# EAGLE design Cell Charger Controller rev1 (EAGLE 9.6.2)
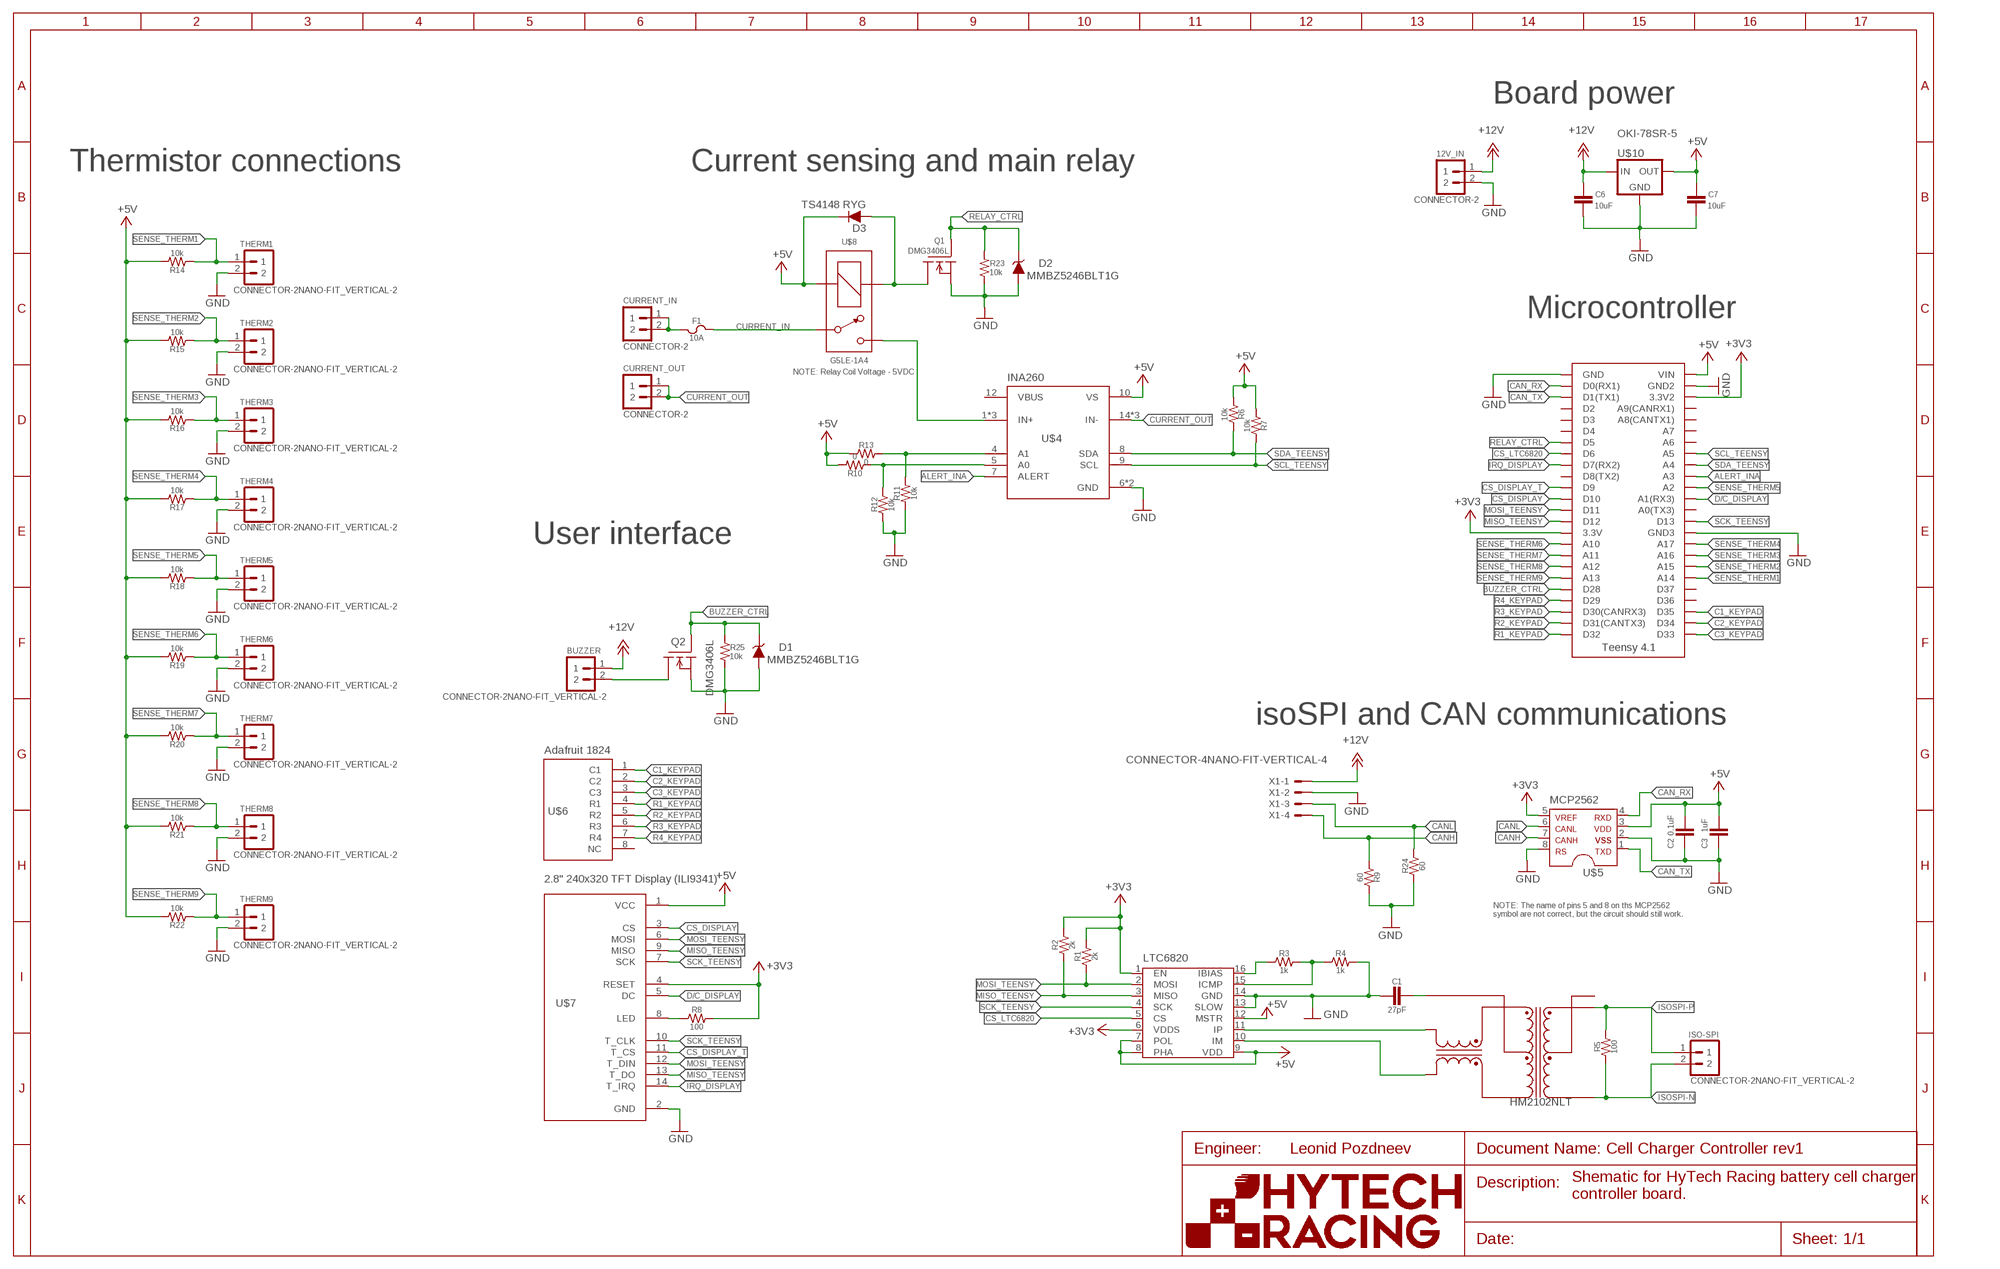
[diagram p0: schematic, sheet 1]
U$1 (FRAME_B): FRAME_DESCRIPTION: Default; ORIENTATION: LANDSCAPE; SIZE: B

## Parts
12V_IN  CONNECTOR-2  [39288020]
BUZZER  CONNECTOR-2NANO-FIT_VERTICAL-2  [1053091202]
C1  27pF  CAP0603-CAP  [0603-CAP]
C2  0.1uF  CAP0603-CAP  [0603-CAP]
C3  1uF  CAP0603-CAP  [0603-CAP]
C6  10uF  CAP0603-CAP  [0603-CAP]
C7  10uF  CAP0603-CAP  [0603-CAP]
CURRENT_IN  CONNECTOR-2  [39288020]
CURRENT_OUT  CONNECTOR-2  [39288020]
D1  MMBZ5246BLT1G  DIODE_ZENER  [SOT23]
D2  MMBZ5246BLT1G  DIODE_ZENER  [SOT23]
D3  TS4148 RYG  DIODE0805  [0805_D]
F1  10A  FUSE_MINIBLADE  [MINI-BLADE_FUSE_HOLDER]
ISO-SPI  CONNECTOR-2NANO-FIT_VERTICAL-2  [1053091202]
Q1  DMG3406L  DMG3406LSOT  [SOT23]
Q2  DMG3406L  DMG3406LSOT  [SOT23]
R1  2k  RESISTOR0603  [0603-RES]
R2  2k  RESISTOR0603  [0603-RES]
R3  1k  RESISTOR0603  [0603-RES]
R4  1k  RESISTOR0603  [0603-RES]
R5  100  RESISTOR0603  [0603-RES]
R6  10k  RESISTOR0603  [0603-RES]
R7  10k  RESISTOR0603  [0603-RES]
R8  100  RESISTOR0603  [0603-RES]
R9  60  RESISTOR0603  [0603-RES]
R10  0  RESISTOR0603  [0603-RES]
R11  10k  RESISTOR0603  [0603-RES]
R12  10k  RESISTOR0603  [0603-RES]
R13  0  RESISTOR0603  [0603-RES]
R14  10k  RESISTOR0603  [0603-RES]
R15  10k  RESISTOR0603  [0603-RES]
R16  10k  RESISTOR0603  [0603-RES]
R17  10k  RESISTOR0603  [0603-RES]
R18  10k  RESISTOR0603  [0603-RES]
R19  10k  RESISTOR0603  [0603-RES]
R20  10k  RESISTOR0603  [0603-RES]
R21  10k  RESISTOR0603  [0603-RES]
R22  10k  RESISTOR0603  [0603-RES]
R23  10k  RESISTOR0603  [0603-RES]
R24  60  RESISTOR0603  [0603-RES]
R25  10k  RESISTOR0603  [0603-RES]
THERM1  CONNECTOR-2NANO-FIT_VERTICAL-2  [1053091202]
THERM2  CONNECTOR-2NANO-FIT_VERTICAL-2  [1053091202]
THERM3  CONNECTOR-2NANO-FIT_VERTICAL-2  [1053091202]
THERM4  CONNECTOR-2NANO-FIT_VERTICAL-2  [1053091202]
THERM5  CONNECTOR-2NANO-FIT_VERTICAL-2  [1053091202]
THERM6  CONNECTOR-2NANO-FIT_VERTICAL-2  [1053091202]
THERM7  CONNECTOR-2NANO-FIT_VERTICAL-2  [1053091202]
THERM8  CONNECTOR-2NANO-FIT_VERTICAL-2  [1053091202]
THERM9  CONNECTOR-2NANO-FIT_VERTICAL-2  [1053091202]
U1  HM2102NLT  [HM2102NLT]
U$2  TEENSY_4.1_SIMPLE  [TEENSY_4.1_SIMPLE]
U$3  LTC6820  [MSOP-16]
U$4  INA260  [TSSOP-16]
U$5  MCP2562FD  [SOIC-08]
U$6  ADAFRUIT_1824_KEYPAD  [ADAFRUIT_1824_KEYPAD]
U$7  ILI9341_TOUCH_SCREEN  [ILI9341_TOUCH_SCREEN]
U$8  G5LE-1A4  [G5LE-1A4]
U$10  OKI-78SR-5  [OKI-78SR]
X1  CONNECTOR-4NANO-FIT-VERTICAL-4  [1053101204]

## Nets
+3V3: R1.2 R2.2 R8.2 U$2.3.3V U$2.3.3V2 U$3.1(EN) U$3.6(VDDS) U$5.5 U$7.4(RESET)
+5V: C2.1 C3.1 C7.1 D3.C R6.1 R7.1 R10.2 R13.1 R14.2 R15.2 R16.2 R17.2 R18.2 R19.2 R20.2 R21.2 R22.2 U$2.VIN U$3.7(POL) U$3.8(PHA) U$3.9(VDD) U$3.12(MSTR) U$4.10(VS) U$5.3 U$7.1(VCC) U$8.2(COIL-) U$10.3(OUT)
+12V: 12V_IN.1 BUZZER.1 C6.1 U$10.1(IN) X1.1
ALERT_INA: U$2.A3 U$4.7(ALERT)
BUZZER_CTRL: D1.3(C) Q2.1(G) R25.2 U$2.D28
C1_KEYPAD: U$2.D35 U$6.1(C1)
C2_KEYPAD: U$2.D34 U$6.2(C2)
C3_KEYPAD: U$2.D33 U$6.3(C3)
CAN_RX: U$2.D0(RX1) U$5.4
CAN_TX: U$2.D1(TX1) U$5.1
CANH: R9.1 U$5.7 X1.4
CANL: R24.2 U$5.6 X1.3
CS_DISPLAY: U$2.D10 U$7.3(CS)
CS_DISPLAY_T: U$2.D9 U$7.11(T_CS)
CS_LTC6820: U$2.D6 U$3.5(CS)
CURRENT_IN: F1.R1 F1.R2 U$8.P
CURRENT_OUT: CURRENT_OUT.1 CURRENT_OUT.2 U$4.14(IN-) U$4.15(IN-) U$4.16(IN-)
D/C_DISPLAY: U$2.A1(RX3) U$7.5(DC)
GND: 12V_IN.2 C1.2 C2.2 C3.2 C6.2 C7.2 D1.1(A) D2.1(A) Q1.2(S) Q2.2(S) R4.2 R9.2 R11.1 R12.1 R23.1 R24.1 R25.1 THERM1.2 THERM2.2 THERM3.2 THERM4.2 THERM5.2 THERM6.2 THERM7.2 THERM8.2 THERM9.2 U$2.GND U$2.GND2 U$2.GND3 U$3.13(SLOW) U$3.14(GND) U$4.6(GND) U$4.11(GND) U$5.2 U$5.8 U$7.2(GND) U$10.2(GND) X1.2
IRQ_DISPLAY: U$2.D7(RX2) U$7.14(T_IRQ)
ISOSPI-N: ISO-SPI.2 R5.1 U1.P$3(MX-)
ISOSPI-P: ISO-SPI.1 R5.2 U1.P$1(MX+)
MISO_TEENSY: R2.1 U$2.D12 U$3.3(MISO) U$7.9(MISO) U$7.13(T_DO)
MOSI_TEENSY: R1.1 U$2.D11 U$3.2(MOSI) U$7.6(MOSI) U$7.12(T_DIN)
N$1: C1.1 U1.P$11(TCT)
N$2: U1.P$12(TD+) U$3.11(IP)
N$3: U1.P$10(TD-) U$3.10(IM)
N$4: R3.1 U$3.16(IBIAS)
N$5: R3.2 R4.1 U$3.15(ICMP)
N$6: R11.2 R13.2 U$4.4(A1)
N$7: R10.1 R12.2 U$4.5(A0)
N$10: R8.1 U$7.8(LED)
N$11: CURRENT_IN.1 CURRENT_IN.2 F1.L1 F1.L2
N$12: U$4.1(IN+) U$4.2(IN+) U$4.3(IN+) U$8.S
N$15: D3.A Q1.3(D) U$8.1(COIL+)
N$16: BUZZER.2 Q2.3(D)
R1_KEYPAD: U$2.D32 U$6.4(R1)
R2_KEYPAD: U$2.D31(CANTX)(D31(CANTX3)) U$6.5(R2)
R3_KEYPAD: U$2.D30(CANRX)(D30(CANRX3)) U$6.6(R3)
R4_KEYPAD: U$2.D29 U$6.7(R4)
RELAY_CTRL: D2.3(C) Q1.1(G) R23.2 U$2.D5
SCK_TEENSY: U$2.D13 U$3.4(SCK) U$7.7(SCK) U$7.10(T_CLK)
SCL_TEENSY: R7.2 U$2.A5 U$4.9(SCL)
SDA_TEENSY: R6.2 U$2.A4 U$4.8(SDA)
SENSE_THERM1: R14.1 THERM1.1 U$2.A14
SENSE_THERM2: R15.1 THERM2.1 U$2.A15
SENSE_THERM3: R16.1 THERM3.1 U$2.A16
SENSE_THERM4: R17.1 THERM4.1 U$2.A17
SENSE_THERM5: R18.1 THERM5.1 U$2.A2
SENSE_THERM6: R19.1 THERM6.1 U$2.A10
SENSE_THERM7: R20.1 THERM7.1 U$2.A11
SENSE_THERM8: R21.1 THERM8.1 U$2.A12
SENSE_THERM9: R22.1 THERM9.1 U$2.A13
Unconnected: U1.P$2(MCT) U1.P$4(MX+) U1.P$5(MCT) U1.P$6(MX-) U1.P$7(TD-) U1.P$8(TCT) U1.P$9(TD+) U$2.A0(TX3) U$2.A6 U$2.A7 U$2.A8(CANTX2)(A8(CANTX1)) U$2.A9(CANRX2)(A9(CANRX1)) U$2.D2 U$2.D3 U$2.D4 U$2.D8(TX2) U$2.D36 U$2.D37 U$4.12(VBUS) U$6.8(NC)

## Notes on the sheet
- Board power
- Thermistor connections | Current sensing and main relay
- Microcontroller
- NOTE: Relay Coil Voltage - 5VDC
- INA260
- User interface
- isoSPI and CAN communications
- MCP2562
- NOTE: The name of pins 5 and 8 on ths MCP2562 
  symbol are not correct, but the circuit should still work.
- LTC6820
- Leonid Pozdneev
- Shematic for HyTech Racing battery cell charger
  controller board.

## Library data of the parts
12V_IN CURRENT_IN CURRENT_OUT = HyTechDevices:CONNECTOR-2: Mini-Fit Junior connector 2 pole Source: http://www.molex.com; OC_FARNELL: 1822072; OC_NEWARK: unknown
BUZZER ISO-SPI THERM1-THERM9 = HyTechDevices:CONNECTOR-2: Mini-Fit Junior connector 2 pole Source: http://www.molex.com
C1-C3 C6 C7 = HyTechDevices:CAP: Capacitor Standard 0603 ceramic capacitor, and 0.1" leaded capacitor.
D1 D2 = HyTechDevices:DIODE_ZENER: ZENER DIODE
D3 = HyTechDevices:DIODE: DIODE general purpose rectifier
F1 = HyTechDevices:FUSE: Fuse/Fuseclips Keystone Electronics 3568 Fuse Mouser Part <http://www.mouser.com/ProductDetail/Keystone-Electronics/3568> Datasheet <http://www.mouser.com/ds/2/215/568-742601.pdf> Bussman/Eaton Midget Fuse Clip 1A3400 <http://www.mouser.com/ProductDetail/Bussmann-Eaton/BK-1A3400-09-R/?qs=sGAEpiMZZMuG%252bgnN5hGYGzzlAelq2OxnKqVSMVjq8I4%3d> Schurter 0751.0110 Brass Fuse Clip Datasheet <http://www.mouser.com/ds/2/358/typ_OG__Clip__5x20-2553.pdf> Bel Fuse 0ZCF Series Surface Mount PTC (resettable) Fuse Datasheet <https://belfuse.com/resources/CircuitProtection/datasheets/0ZCF%20Nov2016.pdf> Littelfuse 1812L Series Surface Mount PTC (resettable) Fuse Datasheet <https://m.littelfuse.com/~/media/electronics/datasheets/resettable_ptcs/littelfuse_ptc_1812l_datasheet.pdf.pdf>
Q1 Q2 = HyTechDevices:DMG3406L: Generic NPN MOSFET DMG3406L (SOT-23, 2.8 A 30V)
R1-R25 = HyTechDevices:RESISTOR: Resistor Basic schematic elements and footprints for 0603, 1206, and PTH resistors.
U1 = HyTechDevices:HM2102NLT: 2 Channel SMT Transformer Turns ratio: 1CT: 1CT Isolation Voltage: 4300 VDC Inductance: 150 uH Leakage Inductance: 0.50 uH max DataSheet <https://www.mouser.com/datasheet/2/336/HM2102NL-1218600.pdf>
U$2 = HyTechDevices:TEENSY_4.1_SIMPLE: Simple version of the Teensy 4.1 board that only uses the 2 main rows of pins, with no perpendicular row with VBat or inner pins.
U$3 = HyTechDevices:LTC6820: Linear Technology isoSPI Isolated Communications Interface Datasheet <http://cds.linear.com/docs/en/datasheet/6820fb.pdf>
U$4 = HyTechDevices:INA260: Digital-output, current, power, and voltage monitor with an I2C and SMBus-compatible interface with an integrated precision shunt resistor. Datasheet <https://www.ti.com/lit/ds/symlink/ina260.pdf?HQS=dis-dk-null-digikeymode-dsf-pf-null-wwe&ts=1616279700017>
U$5 = HyTechDevices:MCP2562FD: MCP2562FD High-Speed CAN Transceiver Product Webpage <https://www.microchip.com/wwwproducts/en/MCP2562FD> Datasheet <https://ww1.microchip.com/downloads/en/DeviceDoc/20005284A.pdf>
U$6 = HyTechDevices:ADAFRUIT_1824_KEYPAD: Adafruit 3x4 matrix keypad (PID 1824) Product page <https://www.adafruit.com/product/1824#description>
U$7 = HyTechDevices:ILI9341_TOUCH_SCREEN: 2.8" 240x320 TFT Touch Screen Display. Uses the ILI9341 controller with SPI interface. It also includes a resistive touchscreen with built-in XPT2046 controller. Product page <https://protosupplies.com/product/tft-lcd-2-8-240x320-rgb-spi-display-with-touchscreen/>
U$8 = HyTechDevices:G5LE-1A4: Omron G5LE SPST Relay DC12 (12VDC) model used Coil voltage: 75% - 170% of nominal voltage Datasheet <https://www.omron.com/ecb/products/pdf/en-g5le.pdf>
U$10 = HyTechDevices:OKI-78SR-5: Murata OKI-78SR 5V 1.5A Non-Isolated Switching Regulator DC/DC - Datasheet <https://power.murata.com/data/power/oki-78sr.pdf>
X1 = HyTechDevices:CONNECTOR-4: Mini-Fit Junior connector 4 pole Source: http://www.molex.com

## Board
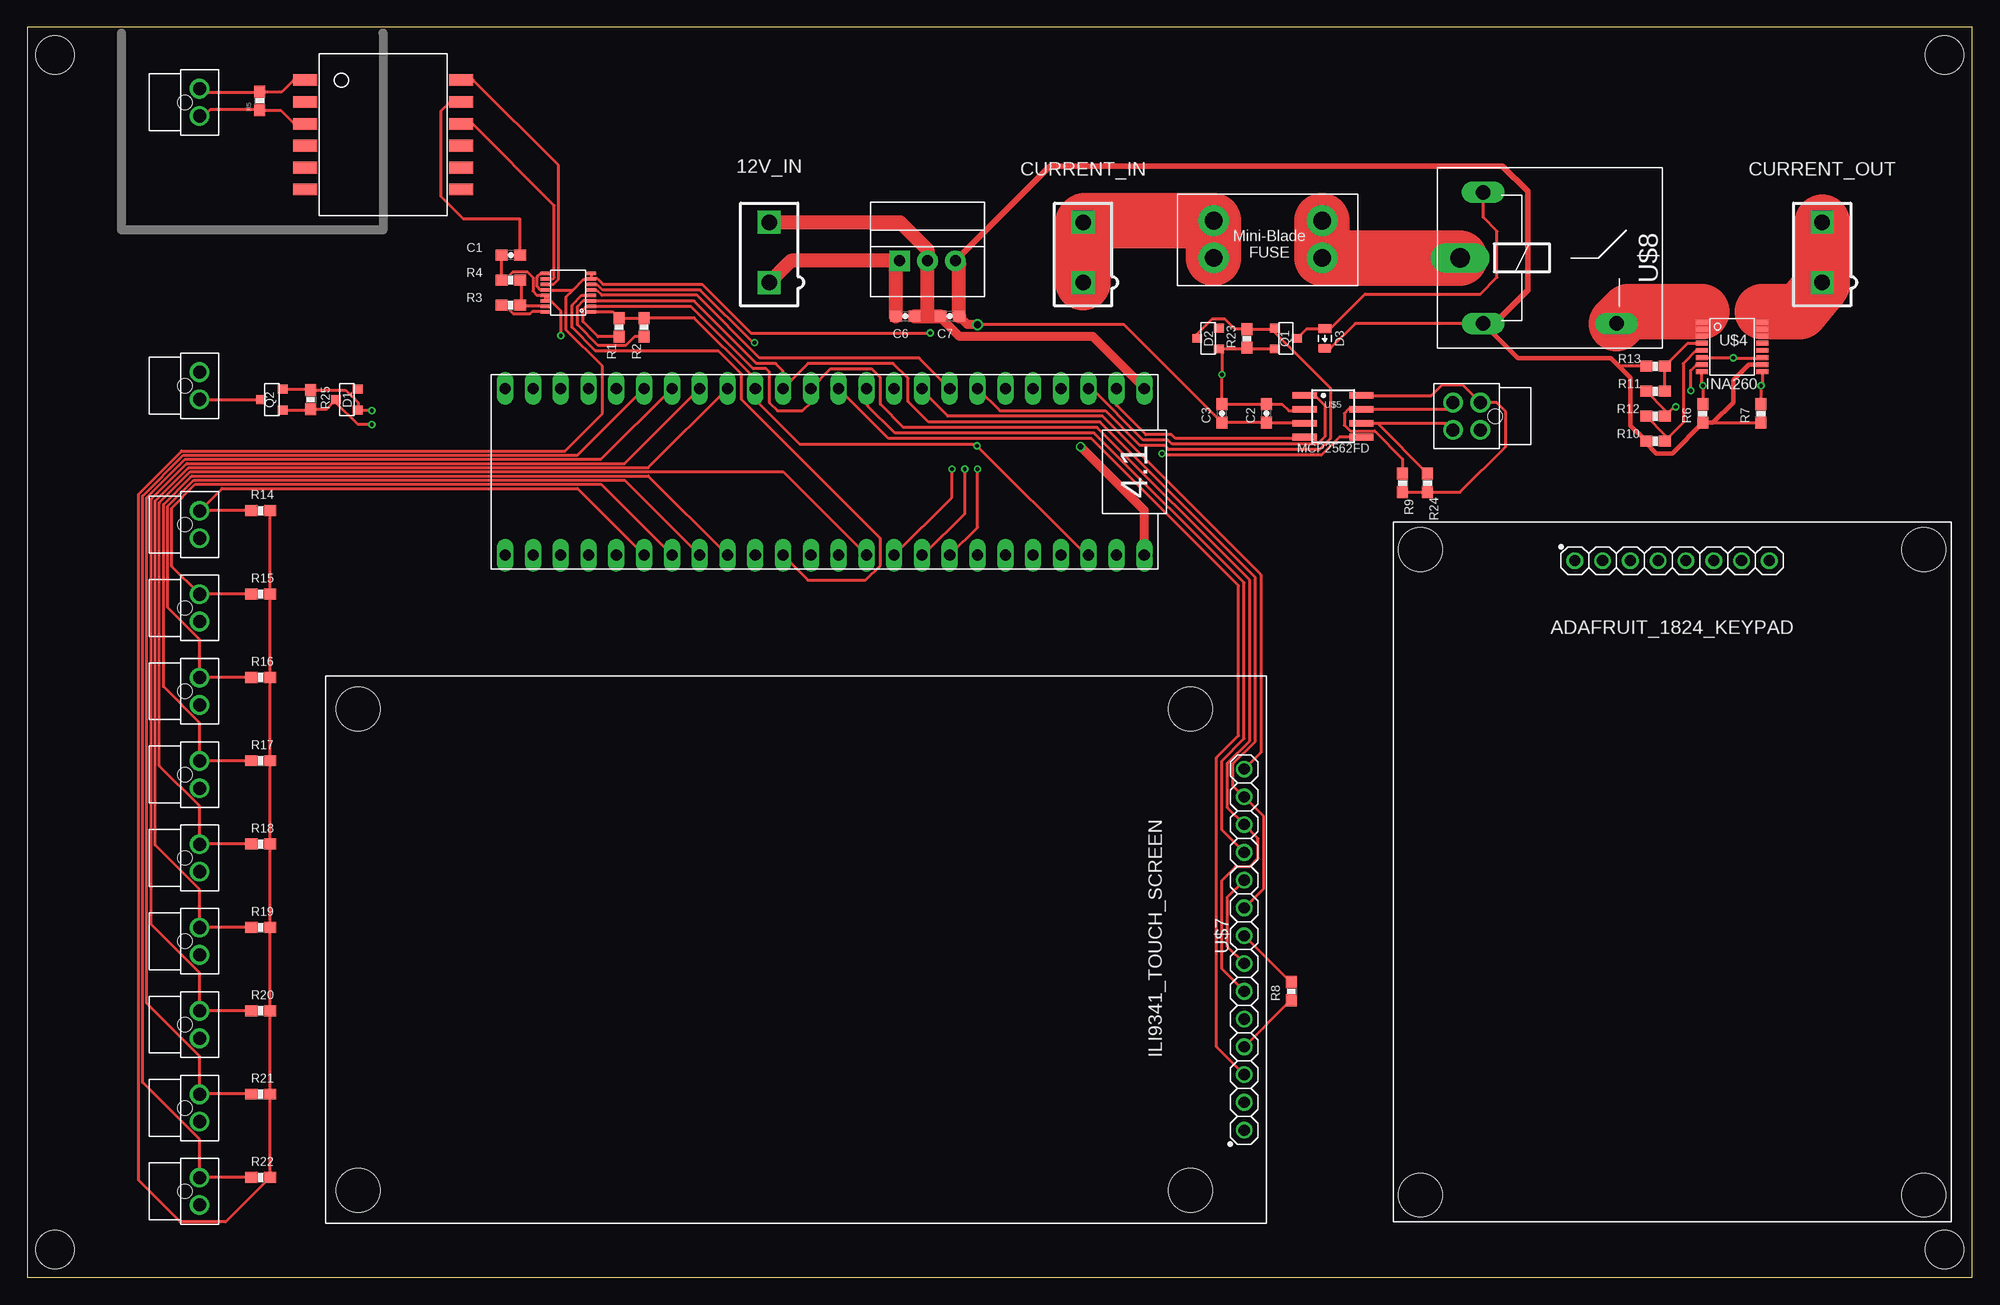
[diagram p1: board, top side]
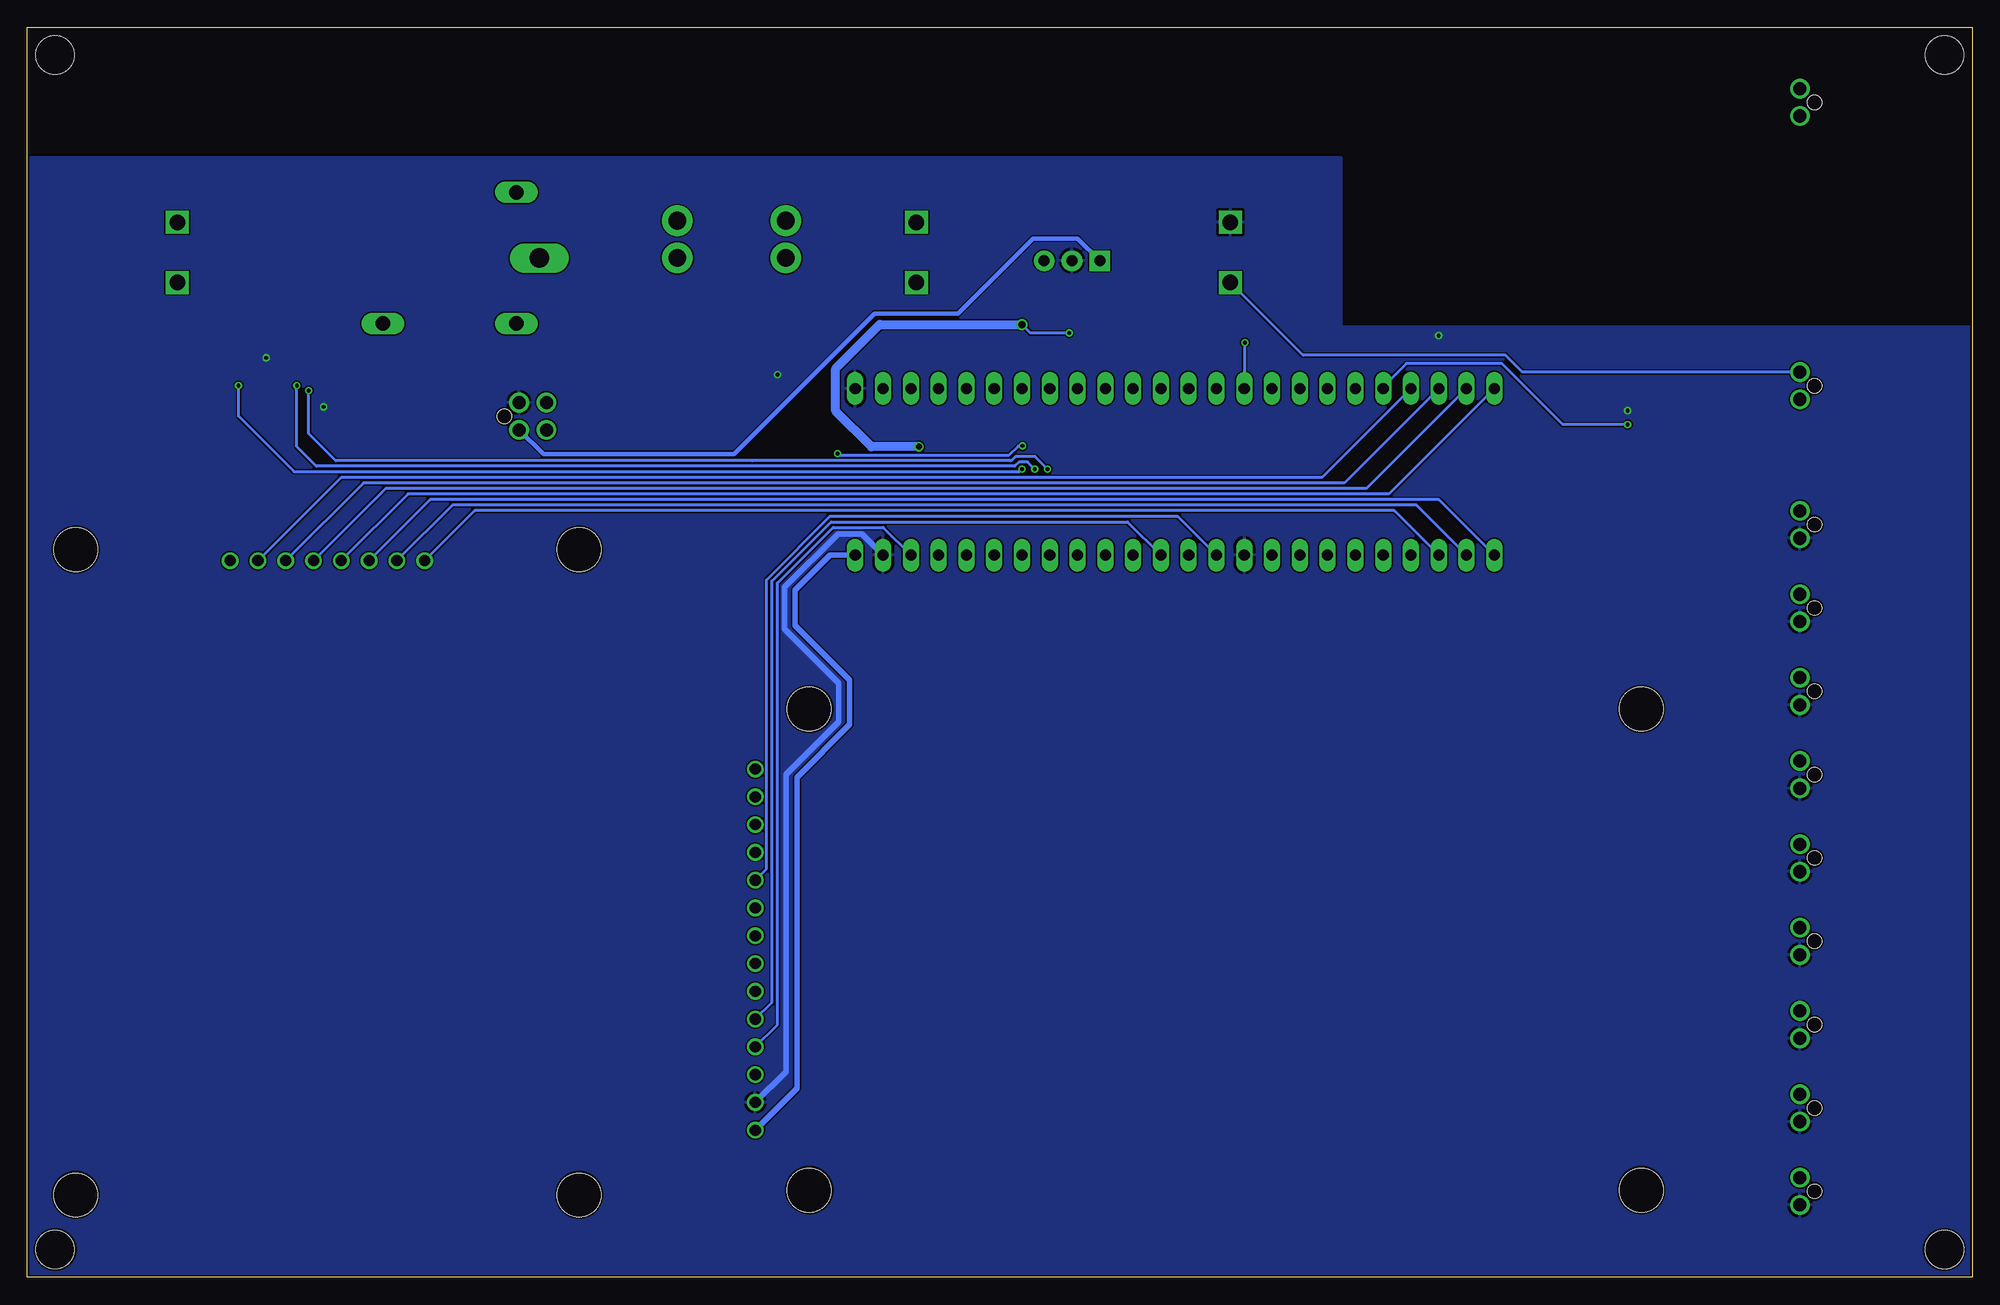
[diagram p2: board, bottom side, seen from below]

Size 177.8 x 114.3 mm. Coordinates in mm from the lower left corner, seen from the top.
Outline: 0,0 177.8,0 177.8,114.3 0,114.3 0,0
Copper layers (1*16): Top 0.035mm / dielectric 1.53mm / Bottom 0.035mm
Design rules "JLCPCB (2 Layer)": minimum track width 5mil, minimum drill 0.3mm, track to track 5mil, track to pad 5mil, pad to pad 5mil, via to via 20mil, smd to smd 5mil, copper to edge 0.2mm, drill to drill 21mil, minimum pad ring 6mil, minimum via ring 6mil, stop-mask expansion 6mil, vias tented up to drill 30mil, thermal gap 10mil
Holes 3.51 mm at 2.54,111.76 2.54,2.54 175.26,2.54 175.26,111.76

### Footprints (pad centres in the part's own frame; a part is rotated, then mirrored left to right if it is on the bottom)
39288020 = drill 1.4 square: 1 0,-2.75; 2 0,2.75
1053091202 = drill 1.2: 1 -1.25,0; 2 1.25,0 | hole 1.3: 0,-1.34
0603-CAP = smd 1.1 x 1: 1 -0.85,0; 2 0.85,0
SOT23 = smd 0.8 x 0.9: 1 -0.95,-1; 2 0.95,-1; 3 0,1
0805_D = smd 0.8 x 1.2: A -0.9,0; C 0.9,0
MINI-BLADE_FUSE_HOLDER = drill 1.613 pad 2.794: L1 0,3.404; L2 0,0; R1 9.906,3.404; R2 9.906,0
0603-RES = smd 1.1 x 1: 1 -0.85,0; 2 0.85,0
HM2102NLT = smd 1.067 x 2.184: P$1 0,0; P$2 2,0; P$3 4,0; P$4 6,0; P$5 8,0; P$6 10,0; P$7 10,14.25; P$8 8,14.25; P$9 6,14.25; P$10 4,14.25; P$11 2,14.25; P$12 0,14.25
TEENSY_4.1_SIMPLE = drill 1.016 long: 3.3V 1.27,24.13; 3.3V2 16.51,54.61; A0(TX3) 16.51,29.21; A1(RX3) 16.51,31.75; A2 16.51,34.29; A3 16.51,36.83; A4 16.51,39.37; A5 16.51,41.91; A6 16.51,44.45; A7 16.51,46.99; A8(CANTX2) 16.51,49.53; A9(CANRX2) 16.51,52.07; A10 1.27,21.59; A11 1.27,19.05; A12 1.27,16.51; A13 1.27,13.97; A14 16.51,13.97; A15 16.51,16.51; A16 16.51,19.05; A17 16.51,21.59; D0(RX1) 1.27,57.15; D1(TX1) 1.27,54.61; D2 1.27,52.07; D3 1.27,49.53; D4 1.27,46.99; D5 1.27,44.45; D6 1.27,41.91; D7(RX2) 1.27,39.37; D8(TX2) 1.27,36.83; D9 1.27,34.29; D10 1.27,31.75; D11 1.27,29.21; D12 1.27,26.67; D13 16.51,26.67; D28 1.27,11.43; D29 1.27,8.89; D30(CANRX) 1.27,6.35; D31(CANTX) 1.27,3.81; D32 1.27,1.27; D33 16.51,1.27; D34 16.51,3.81; D35 16.51,6.35; D36 16.51,8.89; D37 16.51,11.43; GND 1.27,59.69; GND2 16.51,57.15; GND3 16.51,24.13; VIN 16.51,59.69
MSOP-16 = smd 0.305 x 0.889: 1 -0.1,-0.5; 2 0.4,-0.5; 3 0.9,-0.5; 4 1.4,-0.5; 5 1.9,-0.5; 6 2.4,-0.5; 7 2.9,-0.5; 8 3.4,-0.5; 9 3.4,3.7; 10 2.9,3.7; 11 2.4,3.7; 12 1.9,3.7; 13 1.4,3.7; 14 0.9,3.7; 15 0.4,3.7; 16 -0.1,3.7
TSSOP-16 = smd 0.45 x 1.1: 1 -2.275,-2.618; 2 -1.625,-2.618; 3 -0.975,-2.618; 4 -0.325,-2.618; 5 0.325,-2.618; 6 0.975,-2.618; 7 1.625,-2.618; 8 2.275,-2.618; 9 2.275,2.918; 10 1.625,2.918; 11 0.975,2.918; 12 0.325,2.918; 13 -0.325,2.918; 14 -0.975,2.918; 15 -1.625,2.918; 16 -2.275,2.918
SOIC-08 = smd 0.6 x 2.2: 1 -1.905,-2.6; 2 -0.635,-2.6; 3 0.635,-2.6; 4 1.905,-2.6; 5 1.905,2.6; 6 0.635,2.6; 7 -0.635,2.6; 8 -1.905,2.6
ADAFRUIT_1824_KEYPAD = drill 1.016: 1 1.27,0; 2 3.81,0; 3 6.35,0; 4 8.89,0; 5 11.43,0; 6 13.97,0; 7 16.51,0; 8 19.05,0 | hole 3.988: -12.852,1.016; 33.172,1.016; -12.852,-57.988; 33.172,-57.988
ILI9341_TOUCH_SCREEN = drill 1.016: 1 0,0; 2 2.54,0; 3 5.08,0; 4 7.62,0; 5 10.16,0; 6 12.7,0; 7 15.24,0; 8 17.78,0; 9 20.32,0; 10 22.86,0; 11 25.4,0; 12 27.94,0; 13 30.48,0; 14 33.02,0 | hole 4.013: 38.506,4.928; -5.486,4.928; -5.486,81.001; 38.506,81.001
G5LE-1A4 = drill 1.321 long: 1 4.064,14.884; 2 4.064,2.896; S 16.256,2.896 | drill 1.803 long: P 1.956,8.89
OKI-78SR = drill 1 pad 1.88 square: 1 -2.54,0 | drill 1 pad 1.88: 2 0,0; 3 2.54,0
1053101204 = drill 1.2: 1 -1.25,0; 2 1.25,0; 3 -1.25,2.5; 4 1.25,2.5 | hole 1.3: 0,-1.34

### Placement (x,y rotation side)
12V_IN  67.82,93.73 0 top
BUZZER  15.75,81.53 270 top
C1  44.2,93.47 180 top
C2  113.28,78.99 90 top
C3  109.22,78.99 90 top
C6  80.26,87.88 0 top
C7  84.33,87.88 180 top
CURRENT_IN  96.52,93.73 0 top
CURRENT_OUT  164.08,93.73 0 top
D1  29.21,80.26 90 top
D2  107.95,85.85 90 top
D3  118.62,85.85 270 top
F1  108.46,93.22 0 top
ISO-SPI  15.75,107.44 270 top
Q1  115.06,85.85 270 top
Q2  22.35,80.26 90 top
R1  54.1,86.87 90 top
R2  56.39,86.87 90 top
R3  44.2,88.9 0 top
R4  44.2,91.19 180 top
R5  21.26,107.57 90 top
R6  153.16,78.99 90 top
R7  158.5,78.99 90 top
R8  115.57,26.16 270 top
R9  125.73,72.64 270 top
R10  148.84,76.45 180 top
R11  148.84,81.03 0 top
R12  148.84,78.74 180 top
R13  148.84,83.31 0 top
R14  21.34,70.1 0 top
R15  21.34,62.48 0 top
R16  21.34,54.86 0 top
R17  21.34,47.24 0 top
R18  21.34,39.62 0 top
R19  21.34,32 0 top
R20  21.34,24.38 0 top
R21  21.34,16.76 0 top
R22  21.34,9.14 0 top
R23  111.51,85.85 90 top
R24  128.02,72.64 90 top
R25  25.91,80.26 270 top
THERM1  15.75,68.83 270 top
THERM2  15.75,61.21 270 top
THERM3  15.75,53.59 270 top
THERM4  15.75,45.97 270 top
THERM5  15.75,38.35 270 top
THERM6  15.75,30.73 270 top
THERM7  15.75,23.11 270 top
THERM8  15.75,15.49 270 top
THERM9  15.75,7.87 270 top
U1  25.4,109.47 270 top
U$2  42.42,82.55 270 top
U$3  51.05,88.39 90 top
U$4  155.7,85.09 270 top
U$5  119.38,78.74 270 top
U$6  140.21,65.53 0 top
U$7  111.25,13.46 90 top
U$8  129.03,84.33 0 top
U$10  82.3,92.96 0 top
X1  132.84,78.74 90 top

### Tracks (layer width: path | path; a pad name or v marks a point on that pad's centre or on a via)
+3V3  (via drill 0.35)
  Top 0.254: U$7.4 115.48,25.31 R8.2 | U$3.1 53.53,88.29 R1.2 R2.2 60.96,87.72 66.42,82.25 66.42,81.41 U$2.3.3V 66.67,81.15 66.67,80.11 70.58,76.2 86.65,76.2 v86.82,76.03 96.81,66.04 U$2.3.3V2 | U$3.6 52.09,90.79 52.59,90.28 61.52,90.28 66.33,85.48 v66.48,85.48 | U$5.5 119.95,76.83 118.3,75.18 103.89,75.18 v103.73,75.34
  Bottom 0.254: U$7.4 109.22,23.11 109.22,63.5 104.14,68.58 99.57,68.58 U$2.3.3V2 | v66.48,85.48 66.55,85.41 U$2.3.3V | v86.82,76.03 87.2,76.03 88.06,75.18 103.57,75.18 v103.73,75.34
+5V  (via drill 0.35, 0.55, 0.65)
  Top 0.254: U$8.2 121.41,87.22 119.14,84.95 D3.C | R14.2 R15.2 R16.2 R17.2 R18.2 R19.2 R20.2 R21.2 R22.2 18.12,5.08 13.97,5.08 10.16,8.89 10.16,71.62 14.1,75.56 49.15,75.56 52.58,78.99 52.58,83.31 49.28,86.61 49.28,89.67 49.9,90.29 | U$5.3 113.32,78.11 C2.1 C3.1 100.24,87.12 v86.87,87.12 | v82.55,86.36 66.14,86.36 61.7,90.8 52.62,90.8 52.12,91.3 51.56,91.3 U$3.7 | U$3.8 U$3.7 | U$3.7 51.54,91.28 50.88,91.28 49.9,90.29 | 49.9,90.29 U$3.12 46.89,90.29 46.6,90.57 46.6,91.5 46.91,91.8 U$3.9 | R6.1 R7.1 | R13.1 145.54,83.31 144.78,84.07
  Top 0.406: U$4.10 157.38,83.47 155.96,82.04 155.96,80.01 154.09,78.14 R6.1 150.37,75.35 148.93,75.35 147.99,76.29 R10.2 146.56,77.89 146.56,82.3 144.78,84.07 136.25,84.07 U$8.2
  Top 0.508: U$10.3 93.47,101.6 134.87,101.6 137.16,99.31 137.16,90.27 134.11,87.22 U$8.2
  Top 0.813: U$2.VIN 102.11,70.13 v96.29,75.95 | v86.87,87.12 85.94,87.12 C7.1
  Top 1.27: C7.1 85.18,92.62 U$10.3
  Bottom 0.254: v82.55,86.36 86.11,86.36 v86.87,87.12
  Bottom 0.508: U$7.1 107.44,17.27 107.44,45.72 102.62,50.55 102.62,54.61 107.59,59.59 107.59,62.84 104.39,66.04 U$2.VIN
  Bottom 0.813: v96.29,75.95 100.64,75.95 103.91,79.22 103.91,83.09 99.88,87.12 v86.87,87.12
+12V
  Top 1.27: C6.1 79.41,92.62 U$10.1 69.81,92.96 12V_IN.1
  Bottom 0.254: BUZZER.1 41.13,82.78 42.67,84.33 61.17,84.33 12V_IN.1
  Bottom 0.406: U$10.1 81.79,95 85.85,95 92.71,88.14 100.33,88.14 113.21,75.26 130.61,75.26 X1.1
ALERT_INA  (via drill 0.35)
  Top 0.254: U$2.A3 84.53,71.32 v84.53,73.91 | U$4.7 152.61,83.47 152.06,82.93 v152.06,81.09
  Bottom 0.254: v152.06,81.09 152.06,77.14 149.6,74.67 111.5,74.67 87.83,74.67 87.45,75.05 85.67,75.05 v84.53,73.91
BUZZER_CTRL  (via drill 0.35)
  Top 0.254: Q2.1 25.81,79.31 R25.2 27.36,79.41 D1.3 28.21,79.99 30.23,77.98 v31.5,77.98
  Bottom 0.254: v31.5,77.98 37.42,77.98 43.01,83.57 51.73,83.57 53.85,81.45 U$2.D28
C1_KEYPAD
  Bottom 0.254: U$2.D35 52.83,70.1 136.91,70.1 U$6.1
C2_KEYPAD
  Bottom 0.254: U$2.D34 50.8,70.61 138.94,70.61 U$6.2
C3_KEYPAD
  Bottom 0.254: U$2.D33 48.77,71.12 140.97,71.12 U$6.3
CAN_RX
  Top 0.254: U$5.4 116.65,76.71 104.97,76.71 104.61,77.06 102.26,77.06 99.57,79.76 U$2.D0(RX1)
CAN_TX
  Top 0.254: U$5.1 116.91,80.52 117.81,80.52 118.62,79.7 118.62,76.86 117.96,76.2 104.65,76.2 104.27,76.58 102.01,76.58 97.31,81.28 U$2.D1(TX1)
CANH
  Top 0.254: X1.4 129.73,79.38 U$5.7 120.78,79.38 120.4,78.99 120.4,77.93 120.94,77.39 123.19,77.39 125.73,74.84 R9.1
CANL
  Top 0.254: X1.3 129.73,78.11 U$5.6 123.41,78.11 R24.2
CS_DISPLAY
  Top 0.254: U$7.3 108.71,21.08 108.71,47.53 110.73,49.55 110.73,63.26 97.28,76.71 78.74,76.71 U$2.D10
CS_DISPLAY_T
  Top 0.254: U$7.11 109.22,40.89 109.22,47.24 111.24,49.26 111.24,63.52 97.54,77.22 79.3,77.22 76.83,79.69 76.83,81.15 U$2.D9
CS_LTC6820
  Top 0.254: U$2.D6 81.53,84.07 66.95,84.07 61.23,89.79 52.54,89.79 52.04,90.29 U$3.5
CURRENT_IN
  Top 5.08: F1.R1 F1.R2 U$8.P
CURRENT_OUT
  Top 0.254: U$4.15 U$4.14
  Top 0.508: 158.62,88.31 U$4.16 U$4.15
  Top 5.08: CURRENT_OUT.2 CURRENT_OUT.1 164.08,90.84 162.03,88.31 158.62,88.31
D/C_DISPLAY
  Bottom 0.254: U$7.5 109.73,25.15 109.73,63.68 104.32,69.09 77.22,69.09 U$2.A1(RX3)
GND  (via drill 0.35)
  Top 0.254: U$5.2 116.65,79.25 115.32,79.25 114.72,79.84 C2.2 C3.2 v109.22,82.55 109.22,84.63 D2.1 111.41,84.9 R23.1 111.61,84.9 Q1.2 | C1.2 R4.2 43.64,91.19 44.39,91.94 45.7,91.94 46.22,91.42 46.22,90.19 46.63,89.78 U$3.13 | U$3.13 U$3.14 | U$3.13 48.77,88.38 v48.77,86.11 | R11.1 149.69,79.33 R12.1 150.56,79.6 v150.72,79.6 | U$4.6 155.91,84.11 v155.96,84.07 158.58,84.07 U$4.11 | R9.2 R24.1 130.98,71.79 135.16,75.98 135.16,79.14 134.33,79.97 132.86,79.97 X1.2 131.18,81.65 129.36,81.65 128.35,80.64 U$5.8 | Q2.2 25.81,81.21 R25.1 29.1,81.11 29.66,80.56 29.68,80.56 30.23,80.01 30.23,79.33 D1.1 31.43,79.31 v31.5,79.25
  Top 0.813: U$2.GND 102.11,81.33 97.42,86.03 85.23,86.03 83.48,87.78 C7.2
  Top 1.27: C6.2 82.3,87.88 | 82.3,87.88 C7.2 | 82.3,87.88 U$10.2 82.3,93.98 79.8,96.48 12V_IN.2
  Bottom 0.508: U$7.2 108.46,18.8 108.46,45.97 103.63,50.8 103.63,54.36 108.56,59.28 108.56,63.11 103.7,67.97 101.5,67.97 U$2.GND2
  pour Bottom: 0,0 0,86.87 177.55,86.87 177.55,0
  pour Bottom: 57.66,102.36 177.55,102.36 177.55,86.87 57.66,86.87
IRQ_DISPLAY
  Top 0.254: U$7.14 112.78,48.01 112.78,64.26 98.3,78.74 84.16,78.74 81.79,81.11 U$2.D7(RX2)
ISOSPI-N
  Top 0.254: ISO-SPI.2 16.15,106.19 16.73,106.77 21.21,106.77 R5.1 23.14,106.72 24.38,105.47 U1.P$3
ISOSPI-P
  Top 0.254: ISO-SPI.1 16.02,108.69 16.36,108.36 21.2,108.36 R5.2 23.29,108.42 24.35,109.47 U1.P$1
MISO_TEENSY
  Top 0.254: U$7.9 113.03,35.56 113.03,42.16 U$7.13 110.24,44.96 110.24,46.99 112.27,49.02 112.27,64.01 98.07,78.21 82.41,78.21 80.52,80.1 80.52,82.21 79.16,83.57 71.37,83.57 U$2.D12 69.06,81.31 69.06,82.91 68.41,83.57 66.67,83.57 60.96,89.28 51.57,89.28 U$3.3 50.81,89.3 50.3,88.78 50.3,87.12 52.2,85.21 54.71,85.21 55.51,86.02 R2.1
MOSI_TEENSY
  Top 0.254: U$7.6 109.22,28.19 109.22,36.32 110.49,37.59 111.76,37.59 112.52,38.35 112.52,40.13 U$7.12 109.73,42.93 109.73,47.02 111.77,49.06 111.77,63.74 97.79,77.72 80.1,77.72 77.98,79.84 77.98,82.3 77.22,83.06 73.41,83.06 U$2.D11 71.63,80.01 70.87,79.25 68.58,79.25 67.82,80.01 67.82,82.8 67.54,83.08 66.36,83.08 60.66,88.78 51.55,88.78 U$3.2 | U$3.2 | R1.1 52.16,86.02 50.8,87.37 50.8,88.5 51.08,88.78 51.54,88.78 U$3.2
N$1
  Top 0.254: C1.1 45.05,96.77 39.88,96.77 37.85,98.81 37.85,106.68 38.64,107.47 U1.P$11
N$2
  Top 0.254: U$3.11 47.36,90.78 48.06,90.78 48.56,91.29 48.56,101.68 40.77,109.47 U1.P$12
N$3
  Top 0.254: U$3.10 47.36,91.28 48.02,91.28 48.18,91.45 48.18,98.01 40.72,105.47 U1.P$10
N$4
  Top 0.254: R3.1 43.64,88.9 44.39,88.15 45.98,88.15 46.13,88.29 U$3.16
N$5
  Top 0.254: 45.15,88.79 R3.2 | U$3.15 45.15,88.79 | R4.1 45.15,91.08 45.15,88.79
N$6
  Top 0.254: U$4.4 151.8,85.42 R13.2 R11.2
N$7
  Top 0.254: U$4.5 152.58,84.77 151.38,83.57 151.38,78.14 R10.1 149.69,77.04 R12.2
N$10
  Top 0.254: U$7.8 115.48,27.01 R8.1
N$11
  Top 5.08: CURRENT_IN.1 CURRENT_IN.2 96.67,96.62 F1.L1 F1.L2
N$12
  Top 0.508: 153.08,88.31 U$4.1 | U$4.1 U$4.2 | U$4.1 U$4.3
  Top 5.08: U$8.S 146.37,88.31 153.08,88.31
N$15
  Top 0.254: Q1.3 116.96,86.75 D3.A 119.13,86.75 122.29,89.92 132.84,89.92 134.37,91.44 134.37,95.66 133.1,96.93 U$8.1
N$16
  Top 0.254: BUZZER.2 21.33,80.28 Q2.3
R1_KEYPAD
  Bottom 0.254: U$2.D32 53.34,71.63 143,71.63 U$6.4
R2_KEYPAD
  Bottom 0.254: U$2.D31(CANTX) 55.37,72.14 145.03,72.14 U$6.5
R3_KEYPAD
  Bottom 0.254: U$2.D30(CANRX) 57.4,72.64 147.07,72.64 U$6.6
R4_KEYPAD
  Bottom 0.254: U$2.D29 59.44,73.15 149.1,73.15 U$6.7
RELAY_CTRL
  Top 0.254: D2.3 106.95,86.27 108.31,87.63 109.47,87.63 110.4,86.7 R23.2 113.96,86.7 Q1.1 114.06,86.39 119.13,81.33 119.13,76.71 118.11,75.69 104.36,75.69 103.98,76.07 101.73,76.07 98.55,79.25 88.9,79.25 U$2.D5
SCK_TEENSY
  Top 0.254: U$7.7 109.73,30.23 109.73,34.8 U$7.10 | U$2.D13 71.37,63.75 76.62,63.75 77.98,65.11 77.98,67.56 65.28,80.26 65.28,82.61 63.17,84.71 51.94,84.71 49.78,86.87 49.78,88.9 50.68,89.8 U$3.4
  Bottom 0.254: U$7.10 110.24,37.34 110.24,63.78 104.42,69.6 72.64,69.6 U$2.D13
SCL_TEENSY  (via drill 0.35)
  Top 0.254: v86.87,73.91 86.87,68.58 U$2.A5 | U$4.9 158.62,81.66 v158.5,81.53 R7.2
  Bottom 0.254: v86.87,73.91 87.12,73.66 153.42,73.66 158.5,78.74 v158.5,81.53
SDA_TEENSY  (via drill 0.35)
  Top 0.254: v85.7,73.91 85.7,69.85 81.89,66.04 U$2.A4 | U$4.8 153.08,81.61 v153.16,81.53 R6.2
  Bottom 0.254: v85.7,73.91 86.36,74.57 87.14,74.57 87.54,74.17 151.38,74.17 153.16,75.95 v153.16,81.53
SENSE_THERM1
  Top 0.254: R14.1 15.75,70.1 THERM1.1 17.8,72.14 50.29,72.14 U$2.A14
SENSE_THERM2
  Top 0.254: R15.1 15.77,62.48 THERM2.1 13.21,65 13.21,70.36 15.37,72.52 52.45,72.52 U$2.A15
SENSE_THERM3
  Top 0.254: R16.1 15.77,54.86 THERM3.1 15.75,58.33 12.83,61.25 12.83,70.52 15.21,72.9 54.61,72.9 U$2.A16
SENSE_THERM4
  Top 0.254: R17.1 15.77,47.24 THERM4.1 15.75,50.71 12.45,54.01 12.45,70.67 14.96,73.18 15.05,73.28 56.77,73.28 U$2.A17
SENSE_THERM5
  Top 0.254: R18.1 15.77,39.62 THERM5.1 15.75,43.09 12.06,46.77 12.06,70.83 14.89,73.66 69.09,73.66 U$2.A2
SENSE_THERM6
  Top 0.254: R19.1 15.77,32 THERM6.1 15.75,35.47 11.68,39.54 11.68,70.99 14.74,74.04 56.77,74.04 U$2.A10
SENSE_THERM7
  Top 0.254: R20.1 15.77,24.38 THERM7.1 15.75,27.85 11.3,32.3 11.3,71.15 14.58,74.42 54.61,74.42 U$2.A11
SENSE_THERM8
  Top 0.254: R21.1 15.77,16.76 THERM8.1 15.75,20.23 10.92,25.06 10.92,71.31 14.42,74.8 52.45,74.8 U$2.A12
SENSE_THERM9
  Top 0.254: R22.1 15.77,9.14 THERM9.1 15.75,12.61 10.54,17.82 10.54,71.46 14.26,75.18 20.07,75.18 20.32,75.18 50.29,75.18 U$2.A13

### Text on the board
tValues: 2k
tDocu: Cell Charger Controller rev 1 / Designed by Leo Pozdneev | isoSPI | 10A Fuse | 5V Regulator | GLV | BUZZER | CAN + 12V | THERM1 | THERM2 | THERM3 | THERM4 | THERM5 | THERM6 | THERM7 | THERM8 | THERM9